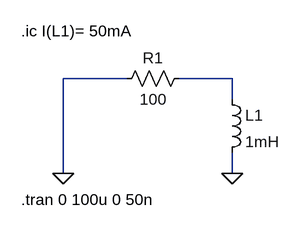
[diagram p0: schematic 04_RL_condicion_inicial.asc]
04_RL_condicion_inicial.asc, the LTspice schematic file:
Version 4
SHEET 1 880 680
WIRE 160 112 64 112
WIRE 320 112 240 112
WIRE 320 144 320 112
WIRE 64 256 64 112
WIRE 320 256 320 224
FLAG 64 256 0
FLAG 320 256 0
SYMBOL ind 304 128 R0
SYMATTR InstName L1
SYMATTR Value 1mH
SYMBOL res 256 96 R90
WINDOW 0 0 56 VBottom 2
WINDOW 3 32 56 VTop 2
SYMATTR InstName R1
SYMATTR Value 100
TEXT 0 296 Left 2 !.tran 0 100u 0 50n
TEXT 0 40 Left 2 !.ic I(L1)= 50mA

The netlist it stands for:
* 04_RL_condicion_inicial.asc
L1 N001 0 1mH
R1 N001 0 100
.tran 0 100u 0 50n
.ic I(L1)= 50mA
.backanno
.end